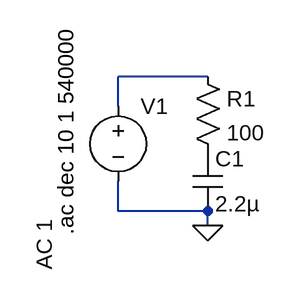
[diagram p0: schematic Filter.asc]
Filter.asc, the LTspice schematic file:
Version 4
SHEET 1 880 680
WIRE 192 80 96 80
WIRE 96 112 96 80
WIRE 96 224 96 192
WIRE 192 224 96 224
WIRE 192 240 192 224
FLAG 192 240 0
SYMBOL cap 176 160 R0
SYMATTR InstName C1
SYMATTR Value 2.2µ
SYMBOL res 176 64 R0
SYMATTR InstName R1
SYMATTR Value 100
SYMBOL voltage 96 96 R0
WINDOW 123 -79 138 VRight 2
WINDOW 39 0 0 Left 0
SYMATTR InstName V1
SYMATTR Value ""
SYMATTR Value2 AC 1
TEXT 40 30 VRight 2 !.ac dec 10 1 540000

The netlist it stands for:
* Filter.asc
C1 P001 0 2.2µ
R1 N001 P001 100
V1 N001 0 AC 1
.ac dec 10 1 540000
.backanno
.end

* Results of the author's LTspice run, read from the files saved beside the schematic
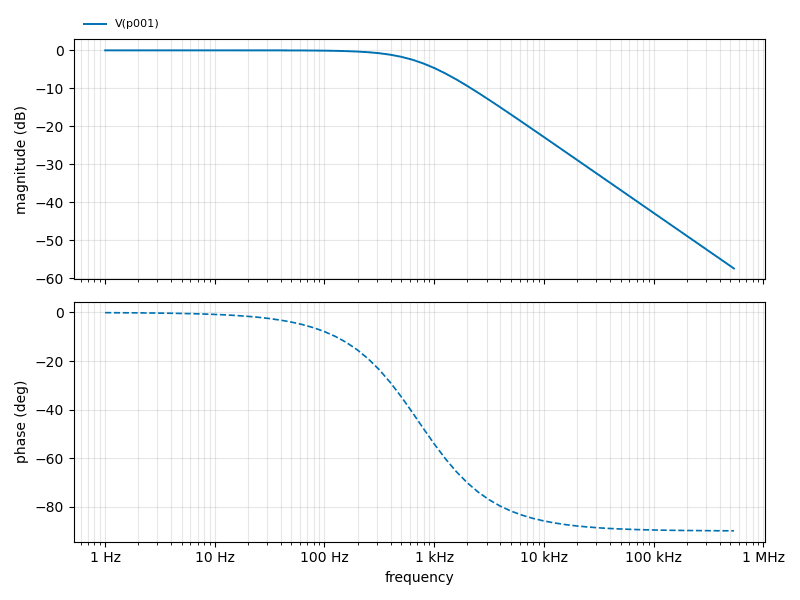
[diagram p1: AC Analysis of Filter.asc, plotted from the saved traces]
* AC Analysis, 1 run:
*   V(p001): -0.00 dB at 1 Hz, -57.46 dB at 540 kHz, peak -0.00 dB at 1 Hz, 3 dB below the peak at 718.7 Hz